# EAGLE design 40 pin BB (EAGLE 6.5.0)
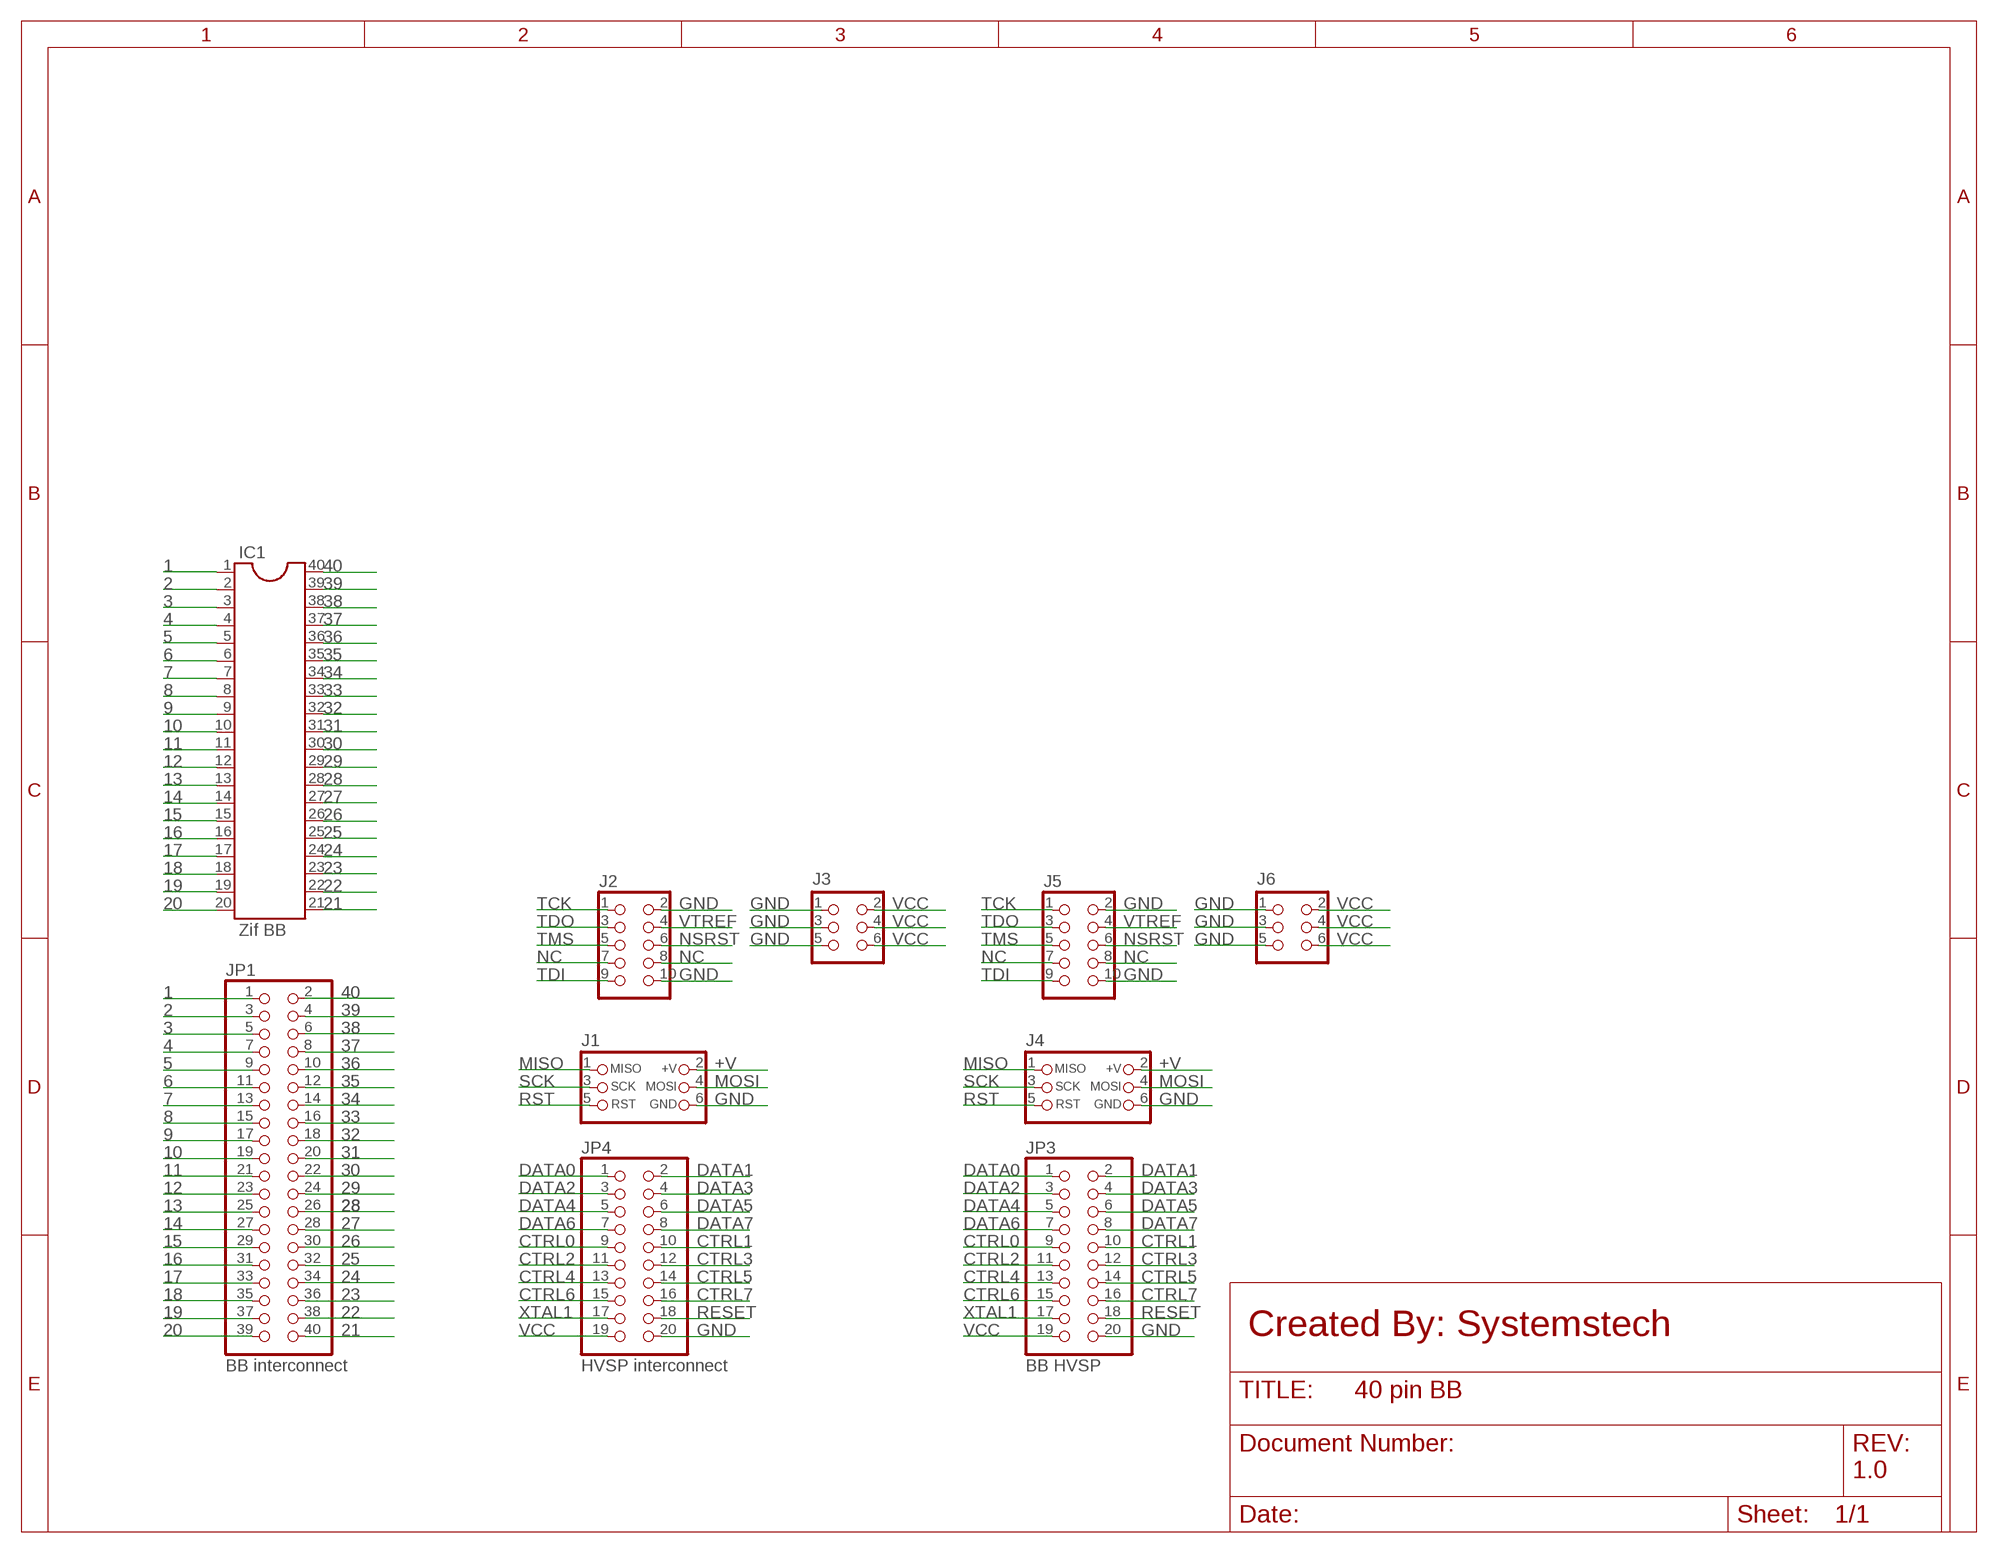
[diagram p0: schematic, sheet 1]

## Parts
IC1  Zif BB  DIL40  [DIL40]
J1  CON_HEADER_PRG_AVR_ICSP  [HEADER_PRG_2X03]
J2  CON_HEADER_2X05-PTH  [M2X5]
J3  CON_HEADER_2X03-PTH  [M2X3]
J4  CON_HEADER_PRG_AVR_ICSP  [HEADER_PRG_2X03]
J5  CON_HEADER_2X05-PTH  [M2X5]
J6  CON_HEADER_2X03-PTH  [M2X3]
JP1  BB interconnect  PINHD-2X20  [2X20]
JP3  BB HVSP  PINHD-2X10  [2X10]
JP4  HVSP interconnect  PINHD-2X10  [2X10]

## Nets
1: IC1.1 JP1.1
2: IC1.2 JP1.3
3: IC1.3 JP1.5
4: IC1.4 JP1.7
5: IC1.5 JP1.9
6: IC1.6 JP1.11
7: IC1.7 JP1.13
8: IC1.8 JP1.15
9: IC1.9 JP1.17
10: IC1.10 JP1.19
11: IC1.11 JP1.21
12: IC1.12 JP1.23
13: IC1.13 JP1.25
14: IC1.14 JP1.27
15: IC1.15 JP1.29
16: IC1.16 JP1.31
17: IC1.17 JP1.33
18: IC1.18 JP1.35
19: IC1.19 JP1.37
20: IC1.20 JP1.39
21: IC1.21 JP1.40
22: IC1.22 JP1.38
23: IC1.23 JP1.36
24: IC1.24 JP1.34
25: IC1.25 JP1.32
26: IC1.26 JP1.30
27: IC1.27 JP1.28
28: IC1.28 JP1.26
29: IC1.29 JP1.24
30: IC1.30 JP1.22
31: IC1.31 JP1.20
32: IC1.32 JP1.18
33: IC1.33 JP1.16
34: IC1.34 JP1.14
35: IC1.35 JP1.12
36: IC1.36 JP1.10
37: IC1.37 JP1.8
38: IC1.38 JP1.6
39: IC1.39 JP1.4
40: IC1.40 JP1.2
+V: J1.2(+V) J4.2(+V)
CTRL0: JP3.9 JP4.9
CTRL1: JP3.10 JP4.10
CTRL2: JP3.11 JP4.11
CTRL3: JP3.12 JP4.12
CTRL4: JP3.13 JP4.13
CTRL5: JP3.14 JP4.14
CTRL6: JP3.15 JP4.15
CTRL7: JP3.16 JP4.16
DATA0: JP3.1 JP4.1
DATA1: JP3.2 JP4.2
DATA2: JP3.3 JP4.3
DATA3: JP3.4 JP4.4
DATA4: JP3.5 JP4.5
DATA5: JP3.6 JP4.6
DATA6: JP3.7 JP4.7
DATA7: JP3.8 JP4.8
GND: J1.6(GND) J2.2 J2.10 J3.1 J3.3 J3.5 J4.6(GND) J5.2 J5.10 J6.1 J6.3 J6.5 JP3.20 JP4.20
MISO: J1.1(MISO) J4.1(MISO)
MOSI: J1.4(MOSI) J4.4(MOSI)
NC: J2.7 J2.8 J5.7 J5.8
NSRST: J2.6 J5.6
RESET: JP3.18 JP4.18
RST: J1.5(RST) J4.5(RST)
SCK: J1.3(SCK) J4.3(SCK)
TCK: J2.1 J5.1
TDI: J2.9 J5.9
TDO: J2.3 J5.3
TMS: J2.5 J5.5
VCC: J3.2 J3.4 J3.6 J6.2 J6.4 J6.6 JP3.19 JP4.19
VTREF: J2.4 J5.4
XTAL1: JP3.17 JP4.17

## Notes on the sheet
- Created By: Systemstech
- 1.0

## Library data of the parts
IC1 = ic-package:DIL40: Dual In Line
J1 J4 = dp_devices:CON_HEADER_PRG_AVR_ICSP: 2x3 AVR ICSP programming header
J2 J5 = dp_devices:CON_HEADER_2X05: 2x05 pin header
J3 J6 = dp_devices:CON_HEADER_2X03
JP1 = pinhead:PINHD-2X20: PIN HEADER
JP3 JP4 = pinhead:PINHD-2X10: PIN HEADER

## Board
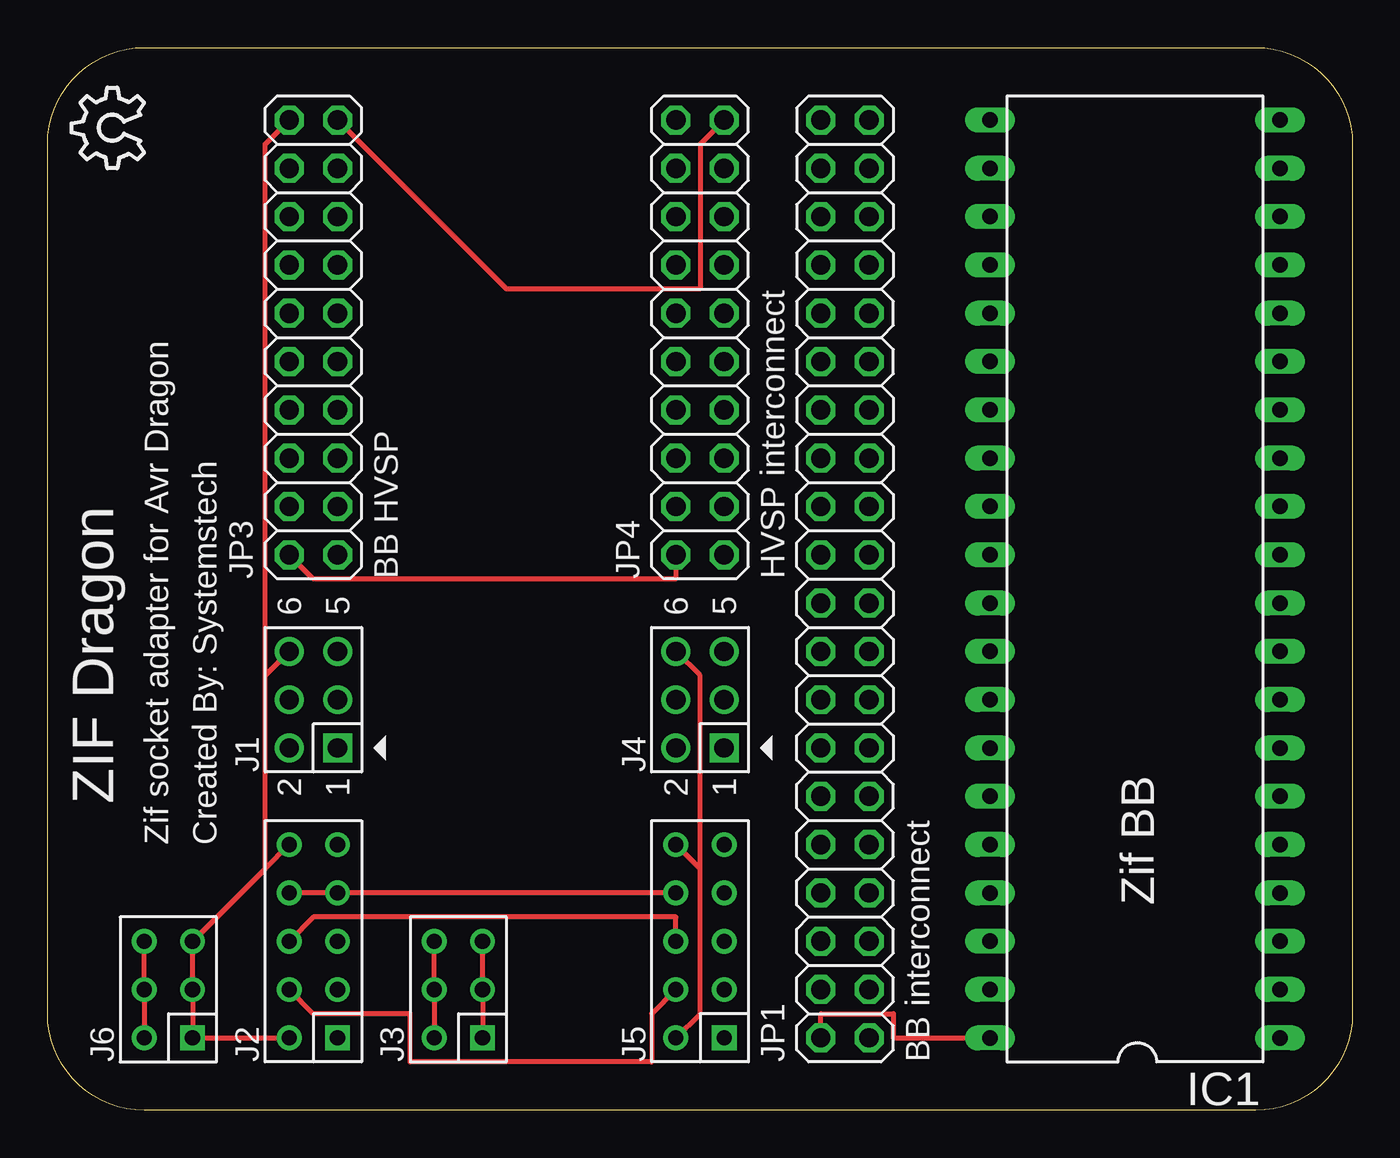
[diagram p1: board, top side]
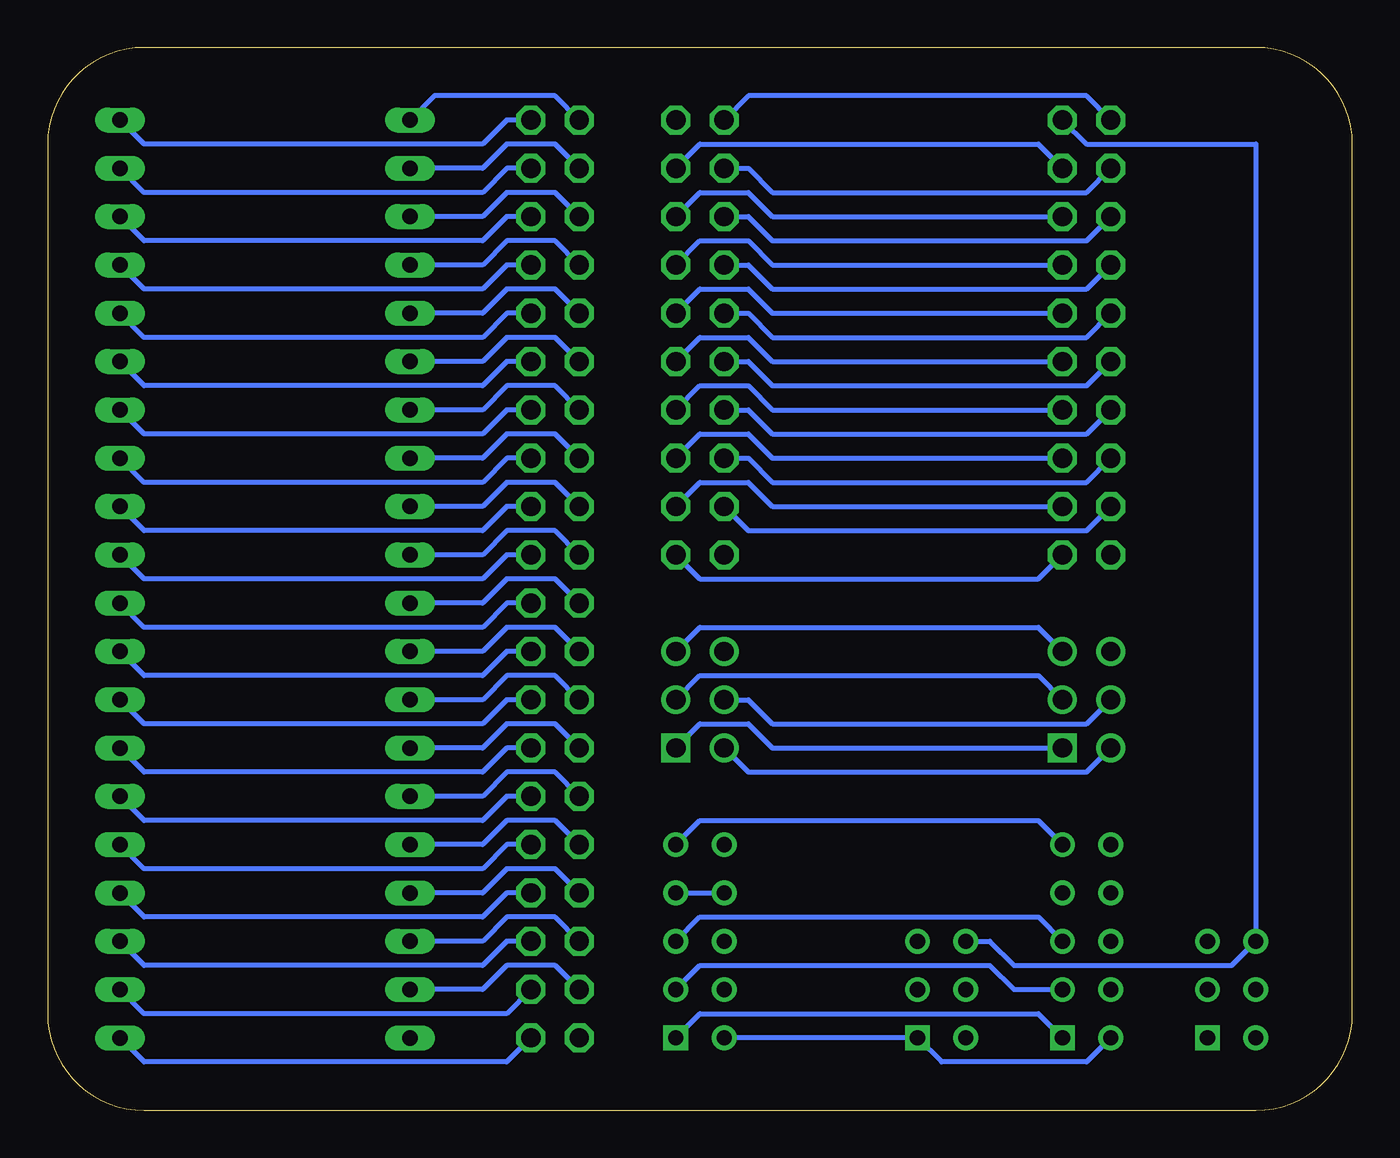
[diagram p2: board, bottom side, seen from below]

Size 68.58 x 55.88 mm. Coordinates in mm from the lower left corner, seen from the top.
Outline: 0,50.8 arc-90 5.08,55.88 63.5,55.88 arc-90 68.58,50.8 68.58,5.08 arc-90 63.5,0 5.08,0 arc-90 0,5.08 0,50.8
Copper layers [2:1+((2*3)+(4*16))]: Top 0.035mm / dielectric 1.5mm / Route2 0.035mm / dielectric 0.15mm / Route3 0.035mm / dielectric 0.2mm / layer 4 0.035mm / dielectric 0.15mm / Bottom 0.035mm
Design rules "default *": minimum track width 10mil, minimum drill 24mil, track to track 8mil, track to pad 8mil, pad to pad 8mil, via to via 8mil, smd to smd 8mil, copper to edge 40mil, drill to drill 8mil, minimum pad ring 10mil, minimum via ring 8mil, stop-mask expansion 4mil, vias tented up to drill 0mil, thermal gap 10mil

### Footprints (pad centres in the part's own frame; a part is rotated, then mirrored left to right if it is on the bottom)
DIL40 = drill 0.813 long: 1 -24.13,-7.62; 2 -21.59,-7.62; 3 -19.05,-7.62; 4 -16.51,-7.62; 5 -13.97,-7.62; 6 -11.43,-7.62; 7 -8.89,-7.62; 8 -6.35,-7.62; 9 -3.81,-7.62; 10 -1.27,-7.62; 11 1.27,-7.62; 12 3.81,-7.62; 13 6.35,-7.62; 14 8.89,-7.62; 15 11.43,-7.62; 16 13.97,-7.62; 17 16.51,-7.62; 18 19.05,-7.62; 19 21.59,-7.62; 20 24.13,-7.62; 21 24.13,7.62; 22 21.59,7.62; 23 19.05,7.62; 24 16.51,7.62; 25 13.97,7.62; 26 11.43,7.62; 27 8.89,7.62; 28 6.35,7.62; 29 3.81,7.62; 30 1.27,7.62; 31 -1.27,7.62; 32 -3.81,7.62; 33 -6.35,7.62; 34 -8.89,7.62; 35 -11.43,7.62; 36 -13.97,7.62; 37 -16.51,7.62; 38 -19.05,7.62; 39 -21.59,7.62; 40 -24.13,7.62
HEADER_PRG_2X03 = drill 1.016 square: 1 -2.54,-1.27 | drill 1.016: 2 -2.54,1.27; 3 0,-1.27; 4 0,1.27; 5 2.54,-1.27; 6 2.54,1.27
M2X5 = drill 0.8 square: 1 -5.08,-1.27 | drill 0.8: 2 -5.08,1.27; 3 -2.54,-1.27; 4 -2.54,1.27; 5 0,-1.27; 6 0,1.27; 7 2.54,-1.27; 8 2.54,1.27; 9 5.08,-1.27; 10 5.08,1.27
M2X3 = drill 0.8 square: 1 -2.54,-1.27 | drill 0.8: 2 -2.54,1.27; 3 0,-1.27; 4 0,1.27; 5 2.54,-1.27; 6 2.54,1.27
2X20 = drill 1.016 octagon: 1 -24.13,-1.27; 2 -24.13,1.27; 3 -21.59,-1.27; 4 -21.59,1.27; 5 -19.05,-1.27; 6 -19.05,1.27; 7 -16.51,-1.27; 8 -16.51,1.27; 9 -13.97,-1.27; 10 -13.97,1.27; 11 -11.43,-1.27; 12 -11.43,1.27; 13 -8.89,-1.27; 14 -8.89,1.27; 15 -6.35,-1.27; 16 -6.35,1.27; 17 -3.81,-1.27; 18 -3.81,1.27; 19 -1.27,-1.27; 20 -1.27,1.27; 21 1.27,-1.27; 22 1.27,1.27; 23 3.81,-1.27; 24 3.81,1.27; 25 6.35,-1.27; 26 6.35,1.27; 27 8.89,-1.27; 28 8.89,1.27; 29 11.43,-1.27; 30 11.43,1.27; 31 13.97,-1.27; 32 13.97,1.27; 33 16.51,-1.27; 34 16.51,1.27; 35 19.05,-1.27; 36 19.05,1.27; 37 21.59,-1.27; 38 21.59,1.27; 39 24.13,-1.27; 40 24.13,1.27
2X10 = drill 1.016 octagon: 1 -11.43,-1.27; 2 -11.43,1.27; 3 -8.89,-1.27; 4 -8.89,1.27; 5 -6.35,-1.27; 6 -6.35,1.27; 7 -3.81,-1.27; 8 -3.81,1.27; 9 -1.27,-1.27; 10 -1.27,1.27; 11 1.27,-1.27; 12 1.27,1.27; 13 3.81,-1.27; 14 3.81,1.27; 15 6.35,-1.27; 16 6.35,1.27; 17 8.89,-1.27; 18 8.89,1.27; 19 11.43,-1.27; 20 11.43,1.27

### Placement (x,y rotation side)
IC1  57.15,27.94 90 top
J1  13.97,21.59 90 top
J2  13.97,8.89 90 top
J3  21.59,6.35 90 top
J4  34.29,21.59 90 top
J5  34.29,8.89 90 top
J6  6.35,6.35 90 top
JP1  41.91,27.94 90 top
JP3  13.97,40.64 90 top
JP4  34.29,40.64 90 top
U$1  [OSHW_8X150_NOTEXT]  5.08,49.53 90 top

### Tracks (layer width: path | path; a pad name or v marks a point on that pad's centre or on a via)
1
  Bottom 0.254: IC1.1 63.5,2.54 44.45,2.54 JP1.1
2
  Bottom 0.254: IC1.2 63.5,5.08 44.45,5.08 JP1.3
3
  Bottom 0.254: IC1.3 63.5,7.62 45.72,7.62 44.45,8.89 JP1.5
4
  Bottom 0.254: IC1.4 63.5,10.16 45.72,10.16 44.45,11.43 JP1.7
5
  Bottom 0.254: IC1.5 63.5,12.7 45.72,12.7 44.45,13.97 JP1.9
6
  Bottom 0.254: IC1.6 63.5,15.24 45.72,15.24 44.45,16.51 JP1.11
7
  Bottom 0.254: IC1.7 63.5,17.78 45.72,17.78 44.45,19.05 JP1.13
8
  Bottom 0.254: IC1.8 63.5,20.32 45.72,20.32 44.45,21.59 JP1.15
9
  Bottom 0.254: IC1.9 63.5,22.86 45.72,22.86 44.45,24.13 JP1.17
10
  Bottom 0.254: IC1.10 63.5,25.4 45.72,25.4 44.45,26.67 JP1.19
11
  Bottom 0.254: IC1.11 63.5,27.94 45.72,27.94 44.45,29.21 JP1.21
12
  Bottom 0.254: IC1.12 63.5,30.48 45.72,30.48 44.45,31.75 JP1.23
13
  Bottom 0.254: IC1.13 63.5,33.02 45.72,33.02 44.45,34.29 JP1.25
14
  Bottom 0.254: IC1.14 63.5,35.56 45.72,35.56 44.45,36.83 JP1.27
15
  Bottom 0.254: IC1.15 63.5,38.1 45.72,38.1 44.45,39.37 JP1.29
16
  Bottom 0.254: IC1.16 63.5,40.64 45.72,40.64 44.45,41.91 JP1.31
17
  Bottom 0.254: IC1.17 63.5,43.18 45.72,43.18 44.45,44.45 JP1.33
18
  Bottom 0.254: IC1.18 63.5,45.72 45.72,45.72 44.45,46.99 JP1.35
19
  Bottom 0.254: IC1.19 63.5,48.26 45.72,48.26 44.45,49.53 JP1.37
20
  Bottom 0.254: IC1.20 63.5,50.8 45.72,50.8 44.45,52.07 JP1.39
21
  Bottom 0.254: IC1.21 48.26,53.34 41.91,53.34 JP1.40
22
  Bottom 0.254: IC1.22 45.72,49.53 44.45,50.8 41.91,50.8 JP1.38
23
  Bottom 0.254: IC1.23 45.72,46.99 44.45,48.26 41.91,48.26 JP1.36
24
  Bottom 0.254: IC1.24 45.72,44.45 44.45,45.72 41.91,45.72 JP1.34
25
  Bottom 0.254: IC1.25 45.72,41.91 44.45,43.18 41.91,43.18 JP1.32
26
  Bottom 0.254: IC1.26 45.72,39.37 44.45,40.64 41.91,40.64 JP1.30
27
  Bottom 0.254: IC1.27 45.72,36.83 44.45,38.1 41.91,38.1 JP1.28
28
  Bottom 0.254: IC1.28 45.72,34.29 44.45,35.56 41.91,35.56 JP1.26
29
  Bottom 0.254: IC1.29 45.72,31.75 44.45,33.02 41.91,33.02 JP1.24
30
  Bottom 0.254: IC1.30 45.72,29.21 44.45,30.48 41.91,30.48 JP1.22
31
  Bottom 0.254: IC1.31 45.72,26.67 44.45,27.94 41.91,27.94 JP1.20
32
  Bottom 0.254: IC1.32 45.72,24.13 44.45,25.4 41.91,25.4 JP1.18
33
  Bottom 0.254: IC1.33 45.72,21.59 44.45,22.86 41.91,22.86 JP1.16
34
  Bottom 0.254: IC1.34 45.72,19.05 44.45,20.32 41.91,20.32 JP1.14
35
  Bottom 0.254: IC1.35 45.72,16.51 44.45,17.78 41.91,17.78 JP1.12
36
  Bottom 0.254: IC1.36 45.72,13.97 44.45,15.24 41.91,15.24 JP1.10
37
  Bottom 0.254: IC1.37 45.72,11.43 44.45,12.7 41.91,12.7 JP1.8
38
  Bottom 0.254: IC1.38 45.72,8.89 44.45,10.16 41.91,10.16 JP1.6
39
  Bottom 0.254: IC1.39 45.72,6.35 44.45,7.62 41.91,7.62 JP1.4
40
  Top 0.254: IC1.40 44.45,3.81 44.45,5.08 40.64,5.08 JP1.2
+V
  Bottom 0.254: J1.2 13.97,17.78 31.75,17.78 J4.2
CTRL0
  Bottom 0.254: JP3.9 30.48,39.37 31.75,40.64 34.29,40.64 JP4.9
CTRL1
  Bottom 0.254: JP3.10 13.97,38.1 30.48,38.1 31.75,39.37 JP4.10
CTRL2
  Bottom 0.254: JP3.11 30.48,41.91 31.75,43.18 34.29,43.18 JP4.11
CTRL3
  Bottom 0.254: JP3.12 13.97,40.64 30.48,40.64 31.75,41.91 JP4.12
CTRL4
  Bottom 0.254: JP3.13 30.48,44.45 31.75,45.72 34.29,45.72 JP4.13
CTRL5
  Bottom 0.254: JP3.14 13.97,43.18 30.48,43.18 31.75,44.45 JP4.14
CTRL6
  Bottom 0.254: JP3.15 30.48,46.99 31.75,48.26 34.29,48.26 JP4.15
CTRL7
  Bottom 0.254: JP3.16 13.97,45.72 30.48,45.72 31.75,46.99 JP4.16
DATA0
  Bottom 0.254: JP3.1 16.51,27.94 34.29,27.94 JP4.1
DATA1
  Top 0.254: JP3.2 13.97,27.94 33.02,27.94 JP4.2
DATA2
  Bottom 0.254: JP3.3 30.48,31.75 31.75,33.02 34.29,33.02 JP4.3
DATA3
  Bottom 0.254: JP3.4 13.97,30.48 31.75,30.48 JP4.4
DATA4
  Bottom 0.254: JP3.5 30.48,34.29 31.75,35.56 34.29,35.56 JP4.5
DATA5
  Bottom 0.254: JP3.6 13.97,33.02 30.48,33.02 31.75,34.29 JP4.6
DATA6
  Bottom 0.254: JP3.7 30.48,36.83 31.75,38.1 34.29,38.1 JP4.7
DATA7
  Bottom 0.254: JP3.8 13.97,35.56 30.48,35.56 31.75,36.83 JP4.8
GND
  Top 0.254: J3.1 J3.3 J3.5 | 34.29,12.7 J5.10 | 34.29,12.7 34.29,5.08 J5.2 | J4.6 34.29,22.86 34.29,12.7 | J2.2 J6.1 J6.3 J6.5 11.43,12.7 | 11.43,12.7 J2.10 | 11.43,22.86 J1.6 | 11.43,12.7 11.43,22.86 | JP3.20 11.43,50.8 11.43,22.86
  Bottom 0.254: J5.2 J3.1 21.59,2.54 13.97,2.54 J2.2 | JP4.20 31.75,53.34 13.97,53.34 JP3.20
MISO
  Bottom 0.254: J1.1 30.48,19.05 31.75,20.32 34.29,20.32 J4.1
MOSI
  Bottom 0.254: J1.4 13.97,20.32 30.48,20.32 31.75,21.59 J4.4
NC
  Top 0.254: J2.8 J2.7 J5.8
  Bottom 0.254: J5.7 J5.8
NSRST
  Top 0.254: J2.6 13.97,10.16 33.02,10.16 J5.6
RESET
  Bottom 0.254: JP3.18 13.97,48.26 30.48,48.26 31.75,49.53 JP4.18
RST
  Bottom 0.254: J1.5 16.51,25.4 34.29,25.4 J4.5
SCK
  Bottom 0.254: J1.3 16.51,22.86 34.29,22.86 J4.3
TCK
  Bottom 0.254: J2.1 16.51,5.08 34.29,5.08 J5.1
TDI
  Bottom 0.254: J2.9 16.51,15.24 34.29,15.24 J5.9
TDO
  Bottom 0.254: J2.3 17.78,6.35 19.05,7.62 34.29,7.62 J5.3
TMS
  Bottom 0.254: J2.5 16.51,10.16 34.29,10.16 J5.5
VCC
  Top 0.254: J6.2 J6.4 J6.6 | J3.2 J3.4 J3.6 | JP3.19 24.13,43.18 34.29,43.18 34.29,50.8 JP4.19
  Bottom 0.254: J3.6 19.05,8.89 17.78,7.62 6.35,7.62 J6.6 5.08,50.8 13.97,50.8 JP3.19
VTREF
  Top 0.254: J2.4 13.97,5.08 19.05,5.08 19.05,2.54 31.75,2.54 31.75,5.08 J5.4
XTAL1
  Bottom 0.254: JP3.17 16.51,50.8 34.29,50.8 JP4.17

### Text on the board
_tsilk: ZIF Dragon | Zif socket adapter for Avr Dragon | Created By: Systemstech